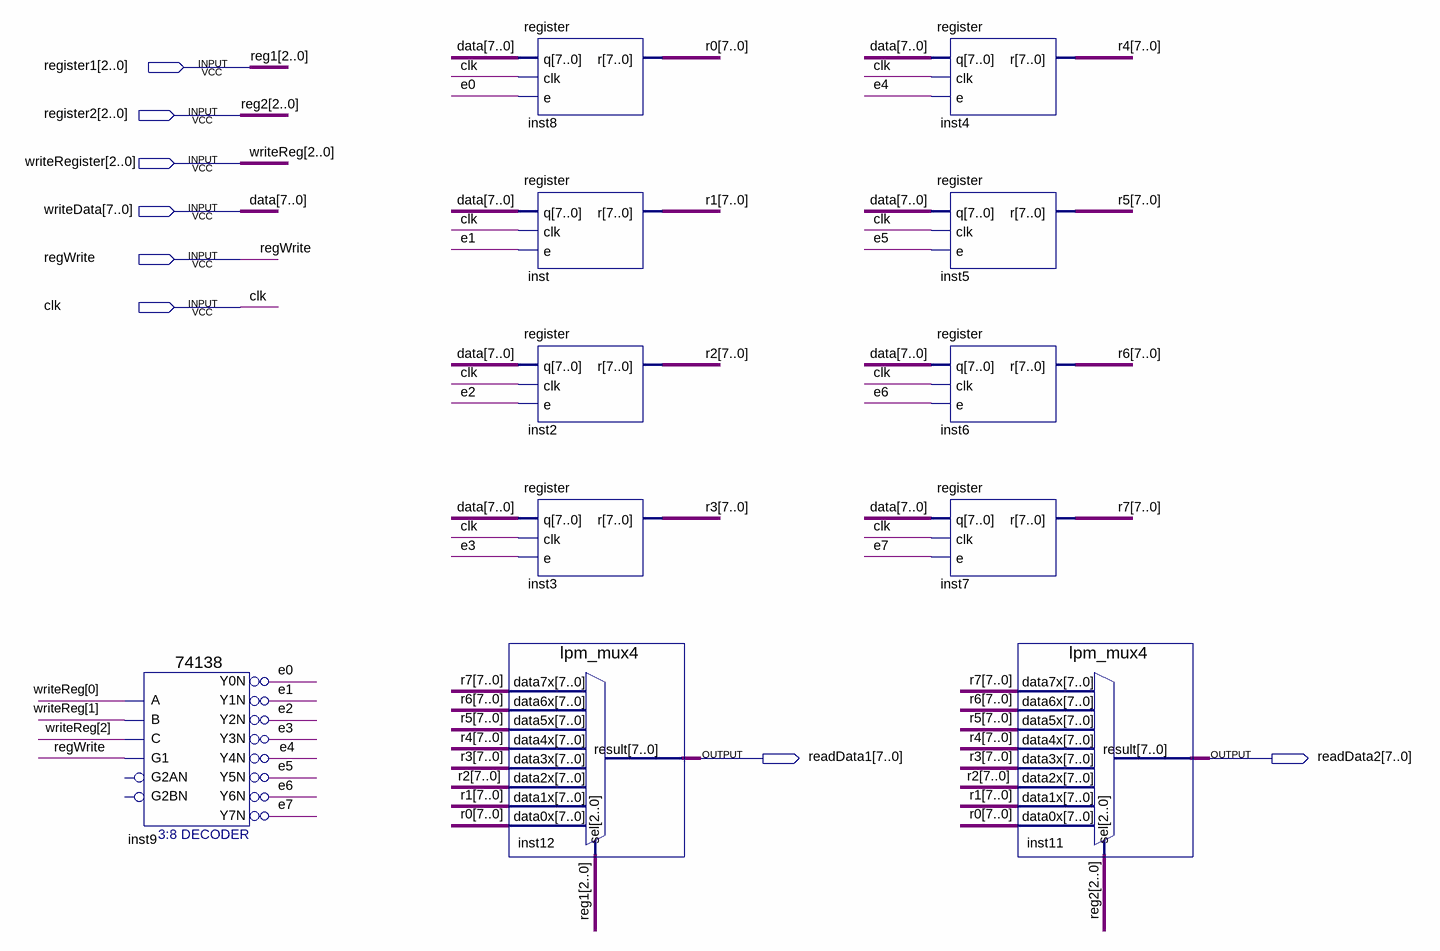
[diagram p0: schematic sheet]
// Quartus schematic RegisterFile.bdf as structural Verilog: 11 symbols, 8 pins
module RegisterFile (
  input  [2:0] register1,
  input  [2:0] register2,
  input  [2:0] writeRegister,
  input  [7:0] writeData,
  input  regWrite,
  input  clk,
  output [7:0] readData1,
  output [7:0] readData2
);

  wire e0, e1, e2, e3, e4, e5, e6, e7, inst9_y0n, inst9_y1n, inst9_y2n, inst9_y3n, inst9_y4n, inst9_y5n,
       inst9_y6n, inst9_y7n;
  wire [7:0] r0, r1, r2, r3, r4, r5, r6, r7;

  \74138  inst9 (
    .A(writeRegister[0]), .B(writeRegister[1]), .C(writeRegister[2]), .G1(regWrite), .Y0N(inst9_y0n),
    .Y1N(inst9_y1n), .Y2N(inst9_y2n), .Y3N(inst9_y3n), .Y4N(inst9_y4n), .Y5N(inst9_y5n), .Y6N(inst9_y6n),
    .Y7N(inst9_y7n));  // open: G2AN, G2BN
  not inst9_Y0N_inverted (e0, inst9_y0n);
  not inst9_Y1N_inverted (e1, inst9_y1n);
  not inst9_Y2N_inverted (e2, inst9_y2n);
  not inst9_Y3N_inverted (e3, inst9_y3n);
  not inst9_Y4N_inverted (e4, inst9_y4n);
  not inst9_Y5N_inverted (e5, inst9_y5n);
  not inst9_Y6N_inverted (e6, inst9_y6n);
  not inst9_Y7N_inverted (e7, inst9_y7n);
  register inst8 (.q(writeData), .clk(clk), .e(e0), .r(r0));
  register inst (.q(writeData), .clk(clk), .e(e1), .r(r1));
  register inst2 (.q(writeData), .clk(clk), .e(e2), .r(r2));
  register inst3 (.q(writeData), .clk(clk), .e(e3), .r(r3));
  lpm_mux4 inst12 (
    .data7x(r7), .data6x(r6), .data5x(r5), .data4x(r4), .data3x(r3), .data2x(r2), .data1x(r1), .data0x(r0),
    .sel(register1), .result(readData1));
  register inst4 (.q(writeData), .clk(clk), .e(e4), .r(r4));
  register inst5 (.q(writeData), .clk(clk), .e(e5), .r(r5));
  register inst6 (.q(writeData), .clk(clk), .e(e6), .r(r6));
  register inst7 (.q(writeData), .clk(clk), .e(e7), .r(r7));
  lpm_mux4 inst11 (
    .data7x(r7), .data6x(r6), .data5x(r5), .data4x(r4), .data3x(r3), .data2x(r2), .data1x(r1), .data0x(r0),
    .sel(register2), .result(readData2));

  // Other names for the same wires on the sheet: data[7:0] = writeData; reg1[2:0] = register1; reg2[2:0] = register2;
  //   writeReg[2:0] = writeRegister
endmodule
